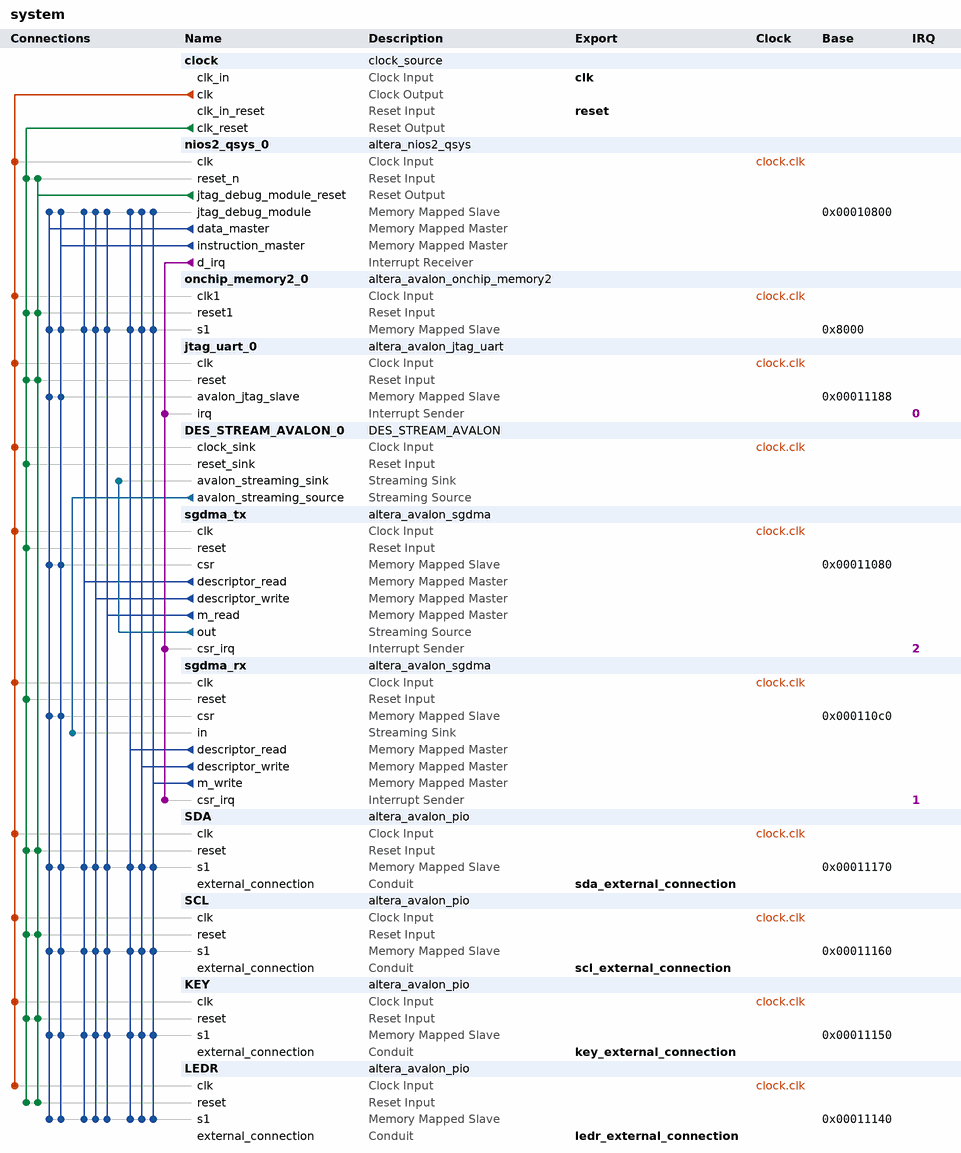
[diagram p0: system contents]
# Platform Designer (Qsys) system system, Cyclone II EP2C35F672C6
# Parameters at their usual value, and those the tool derives, are not listed.
package require -exact qsys 13.0.1.99.2
create_system system
set_project_property DEVICE_FAMILY {Cyclone II}
set_project_property DEVICE EP2C35F672C6

add_instance clock clock_source 13.0
set_instance_parameter_value clock clockFrequency 50000000

add_instance nios2_qsys_0 altera_nios2_qsys 13.0
set_instance_parameter_value nios2_qsys_0 resetSlave onchip_memory2_0.s1
set_instance_parameter_value nios2_qsys_0 mmu_TLBMissExcSlave None
set_instance_parameter_value nios2_qsys_0 exceptionSlave onchip_memory2_0.s1
set_instance_parameter_value nios2_qsys_0 breakSlave nios2_qsys_0.jtag_debug_module
set_instance_parameter_value nios2_qsys_0 impl Tiny
set_instance_parameter_value nios2_qsys_0 icache_size 4096

add_instance onchip_memory2_0 altera_avalon_onchip_memory2 13.0.1.99.2
set_instance_parameter_value onchip_memory2_0 dataWidth 32
set_instance_parameter_value onchip_memory2_0 dualPort false
set_instance_parameter_value onchip_memory2_0 initMemContent true
set_instance_parameter_value onchip_memory2_0 initializationFileName onchip_mem.hex
set_instance_parameter_value onchip_memory2_0 memorySize 32768

add_instance jtag_uart_0 altera_avalon_jtag_uart 13.0.1.99.2
set_instance_parameter_value jtag_uart_0 simInteractiveOptions NO_INTERACTIVE_WINDOWS

add_instance DES_STREAM_AVALON_0 DES_STREAM_AVALON 1.0

add_instance sgdma_tx altera_avalon_sgdma 13.0.1.99.2
set_instance_parameter_value sgdma_tx enableBurstTransfers false
set_instance_parameter_value sgdma_tx enableUnalignedTransfers false
set_instance_parameter_value sgdma_tx readBlockDataWidth 32
set_instance_parameter_value sgdma_tx sinkErrorWidth 0
set_instance_parameter_value sgdma_tx sourceErrorWidth 0
set_instance_parameter_value sgdma_tx transferMode MEMORY_TO_STREAM
set_instance_parameter_value sgdma_tx writeBurstcountWidth 4

add_instance sgdma_rx altera_avalon_sgdma 13.0.1.99.2
set_instance_parameter_value sgdma_rx enableBurstTransfers false
set_instance_parameter_value sgdma_rx enableUnalignedTransfers false
set_instance_parameter_value sgdma_rx readBlockDataWidth 32
set_instance_parameter_value sgdma_rx sinkErrorWidth 0
set_instance_parameter_value sgdma_rx sourceErrorWidth 0
set_instance_parameter_value sgdma_rx transferMode STREAM_TO_MEMORY
set_instance_parameter_value sgdma_rx writeBurstcountWidth 4

add_instance SDA altera_avalon_pio 13.0.1.99.2
set_instance_parameter_value SDA direction Bidir
set_instance_parameter_value SDA width 1

add_instance SCL altera_avalon_pio 13.0.1.99.2
set_instance_parameter_value SCL direction Output
set_instance_parameter_value SCL width 1

add_instance KEY altera_avalon_pio 13.0.1.99.2
set_instance_parameter_value KEY direction Input
set_instance_parameter_value KEY width 4

add_instance LEDR altera_avalon_pio 13.0.1.99.2
set_instance_parameter_value LEDR direction Output
set_instance_parameter_value LEDR width 18

# connections
add_connection clock.clk DES_STREAM_AVALON_0.clock_sink clock
add_connection clock.clk jtag_uart_0.clk clock
add_connection clock.clk KEY.clk clock
add_connection clock.clk LEDR.clk clock
add_connection clock.clk nios2_qsys_0.clk clock
add_connection clock.clk onchip_memory2_0.clk1 clock
add_connection clock.clk SCL.clk clock
add_connection clock.clk SDA.clk clock
add_connection clock.clk sgdma_rx.clk clock
add_connection clock.clk sgdma_tx.clk clock
add_connection clock.clk_reset DES_STREAM_AVALON_0.reset_sink reset
add_connection clock.clk_reset jtag_uart_0.reset reset
add_connection clock.clk_reset KEY.reset reset
add_connection clock.clk_reset LEDR.reset reset
add_connection clock.clk_reset nios2_qsys_0.reset_n reset
add_connection clock.clk_reset onchip_memory2_0.reset1 reset
add_connection clock.clk_reset SCL.reset reset
add_connection clock.clk_reset SDA.reset reset
add_connection clock.clk_reset sgdma_rx.reset reset
add_connection clock.clk_reset sgdma_tx.reset reset
add_connection nios2_qsys_0.jtag_debug_module_reset jtag_uart_0.reset reset
add_connection nios2_qsys_0.jtag_debug_module_reset KEY.reset reset
add_connection nios2_qsys_0.jtag_debug_module_reset LEDR.reset reset
add_connection nios2_qsys_0.jtag_debug_module_reset nios2_qsys_0.reset_n reset
add_connection nios2_qsys_0.jtag_debug_module_reset onchip_memory2_0.reset1 reset
add_connection nios2_qsys_0.jtag_debug_module_reset SCL.reset reset
add_connection nios2_qsys_0.jtag_debug_module_reset SDA.reset reset
add_connection nios2_qsys_0.data_master jtag_uart_0.avalon_jtag_slave avalon
set_connection_parameter_value nios2_qsys_0.data_master/jtag_uart_0.avalon_jtag_slave baseAddress 0x00011188
add_connection nios2_qsys_0.data_master KEY.s1 avalon
set_connection_parameter_value nios2_qsys_0.data_master/KEY.s1 baseAddress 0x00011150
add_connection nios2_qsys_0.data_master LEDR.s1 avalon
set_connection_parameter_value nios2_qsys_0.data_master/LEDR.s1 baseAddress 0x00011140
add_connection nios2_qsys_0.data_master nios2_qsys_0.jtag_debug_module avalon
set_connection_parameter_value nios2_qsys_0.data_master/nios2_qsys_0.jtag_debug_module baseAddress 0x00010800
add_connection nios2_qsys_0.data_master onchip_memory2_0.s1 avalon
set_connection_parameter_value nios2_qsys_0.data_master/onchip_memory2_0.s1 baseAddress 0x8000
add_connection nios2_qsys_0.data_master SCL.s1 avalon
set_connection_parameter_value nios2_qsys_0.data_master/SCL.s1 baseAddress 0x00011160
add_connection nios2_qsys_0.data_master SDA.s1 avalon
set_connection_parameter_value nios2_qsys_0.data_master/SDA.s1 baseAddress 0x00011170
add_connection nios2_qsys_0.data_master sgdma_rx.csr avalon
set_connection_parameter_value nios2_qsys_0.data_master/sgdma_rx.csr baseAddress 0x000110c0
add_connection nios2_qsys_0.data_master sgdma_tx.csr avalon
set_connection_parameter_value nios2_qsys_0.data_master/sgdma_tx.csr baseAddress 0x00011080
add_connection nios2_qsys_0.instruction_master jtag_uart_0.avalon_jtag_slave avalon
set_connection_parameter_value nios2_qsys_0.instruction_master/jtag_uart_0.avalon_jtag_slave baseAddress 0x00011188
add_connection nios2_qsys_0.instruction_master KEY.s1 avalon
set_connection_parameter_value nios2_qsys_0.instruction_master/KEY.s1 baseAddress 0x00011150
add_connection nios2_qsys_0.instruction_master LEDR.s1 avalon
set_connection_parameter_value nios2_qsys_0.instruction_master/LEDR.s1 baseAddress 0x00011140
add_connection nios2_qsys_0.instruction_master nios2_qsys_0.jtag_debug_module avalon
set_connection_parameter_value nios2_qsys_0.instruction_master/nios2_qsys_0.jtag_debug_module baseAddress 0x00010800
add_connection nios2_qsys_0.instruction_master onchip_memory2_0.s1 avalon
set_connection_parameter_value nios2_qsys_0.instruction_master/onchip_memory2_0.s1 baseAddress 0x8000
add_connection nios2_qsys_0.instruction_master SCL.s1 avalon
set_connection_parameter_value nios2_qsys_0.instruction_master/SCL.s1 baseAddress 0x00011160
add_connection nios2_qsys_0.instruction_master SDA.s1 avalon
set_connection_parameter_value nios2_qsys_0.instruction_master/SDA.s1 baseAddress 0x00011170
add_connection nios2_qsys_0.instruction_master sgdma_rx.csr avalon
set_connection_parameter_value nios2_qsys_0.instruction_master/sgdma_rx.csr baseAddress 0x000110c0
add_connection nios2_qsys_0.instruction_master sgdma_tx.csr avalon
set_connection_parameter_value nios2_qsys_0.instruction_master/sgdma_tx.csr baseAddress 0x00011080
add_connection sgdma_rx.descriptor_read KEY.s1 avalon
set_connection_parameter_value sgdma_rx.descriptor_read/KEY.s1 baseAddress 0x00011150
add_connection sgdma_rx.descriptor_read LEDR.s1 avalon
set_connection_parameter_value sgdma_rx.descriptor_read/LEDR.s1 baseAddress 0x00011140
add_connection sgdma_rx.descriptor_read nios2_qsys_0.jtag_debug_module avalon
set_connection_parameter_value sgdma_rx.descriptor_read/nios2_qsys_0.jtag_debug_module baseAddress 0x00010800
add_connection sgdma_rx.descriptor_read onchip_memory2_0.s1 avalon
set_connection_parameter_value sgdma_rx.descriptor_read/onchip_memory2_0.s1 baseAddress 0x8000
add_connection sgdma_rx.descriptor_read SCL.s1 avalon
set_connection_parameter_value sgdma_rx.descriptor_read/SCL.s1 baseAddress 0x00011160
add_connection sgdma_rx.descriptor_read SDA.s1 avalon
set_connection_parameter_value sgdma_rx.descriptor_read/SDA.s1 baseAddress 0x00011170
add_connection sgdma_rx.descriptor_write KEY.s1 avalon
set_connection_parameter_value sgdma_rx.descriptor_write/KEY.s1 baseAddress 0x00011150
add_connection sgdma_rx.descriptor_write LEDR.s1 avalon
set_connection_parameter_value sgdma_rx.descriptor_write/LEDR.s1 baseAddress 0x00011140
add_connection sgdma_rx.descriptor_write nios2_qsys_0.jtag_debug_module avalon
set_connection_parameter_value sgdma_rx.descriptor_write/nios2_qsys_0.jtag_debug_module baseAddress 0x00010800
add_connection sgdma_rx.descriptor_write onchip_memory2_0.s1 avalon
set_connection_parameter_value sgdma_rx.descriptor_write/onchip_memory2_0.s1 baseAddress 0x8000
add_connection sgdma_rx.descriptor_write SCL.s1 avalon
set_connection_parameter_value sgdma_rx.descriptor_write/SCL.s1 baseAddress 0x00011160
add_connection sgdma_rx.descriptor_write SDA.s1 avalon
set_connection_parameter_value sgdma_rx.descriptor_write/SDA.s1 baseAddress 0x00011170
add_connection sgdma_rx.m_write KEY.s1 avalon
set_connection_parameter_value sgdma_rx.m_write/KEY.s1 baseAddress 0x00011150
add_connection sgdma_rx.m_write LEDR.s1 avalon
set_connection_parameter_value sgdma_rx.m_write/LEDR.s1 baseAddress 0x00011140
add_connection sgdma_rx.m_write nios2_qsys_0.jtag_debug_module avalon
set_connection_parameter_value sgdma_rx.m_write/nios2_qsys_0.jtag_debug_module baseAddress 0x00010800
add_connection sgdma_rx.m_write onchip_memory2_0.s1 avalon
set_connection_parameter_value sgdma_rx.m_write/onchip_memory2_0.s1 baseAddress 0x8000
add_connection sgdma_rx.m_write SCL.s1 avalon
set_connection_parameter_value sgdma_rx.m_write/SCL.s1 baseAddress 0x00011160
add_connection sgdma_rx.m_write SDA.s1 avalon
set_connection_parameter_value sgdma_rx.m_write/SDA.s1 baseAddress 0x00011170
add_connection sgdma_tx.descriptor_read KEY.s1 avalon
set_connection_parameter_value sgdma_tx.descriptor_read/KEY.s1 baseAddress 0x00011150
add_connection sgdma_tx.descriptor_read LEDR.s1 avalon
set_connection_parameter_value sgdma_tx.descriptor_read/LEDR.s1 baseAddress 0x00011140
add_connection sgdma_tx.descriptor_read nios2_qsys_0.jtag_debug_module avalon
set_connection_parameter_value sgdma_tx.descriptor_read/nios2_qsys_0.jtag_debug_module baseAddress 0x00010800
add_connection sgdma_tx.descriptor_read onchip_memory2_0.s1 avalon
set_connection_parameter_value sgdma_tx.descriptor_read/onchip_memory2_0.s1 baseAddress 0x8000
add_connection sgdma_tx.descriptor_read SCL.s1 avalon
set_connection_parameter_value sgdma_tx.descriptor_read/SCL.s1 baseAddress 0x00011160
add_connection sgdma_tx.descriptor_read SDA.s1 avalon
set_connection_parameter_value sgdma_tx.descriptor_read/SDA.s1 baseAddress 0x00011170
add_connection sgdma_tx.descriptor_write KEY.s1 avalon
set_connection_parameter_value sgdma_tx.descriptor_write/KEY.s1 baseAddress 0x00011150
add_connection sgdma_tx.descriptor_write LEDR.s1 avalon
set_connection_parameter_value sgdma_tx.descriptor_write/LEDR.s1 baseAddress 0x00011140
add_connection sgdma_tx.descriptor_write nios2_qsys_0.jtag_debug_module avalon
set_connection_parameter_value sgdma_tx.descriptor_write/nios2_qsys_0.jtag_debug_module baseAddress 0x00010800
add_connection sgdma_tx.descriptor_write onchip_memory2_0.s1 avalon
set_connection_parameter_value sgdma_tx.descriptor_write/onchip_memory2_0.s1 baseAddress 0x8000
add_connection sgdma_tx.descriptor_write SCL.s1 avalon
set_connection_parameter_value sgdma_tx.descriptor_write/SCL.s1 baseAddress 0x00011160
add_connection sgdma_tx.descriptor_write SDA.s1 avalon
set_connection_parameter_value sgdma_tx.descriptor_write/SDA.s1 baseAddress 0x00011170
add_connection sgdma_tx.m_read KEY.s1 avalon
set_connection_parameter_value sgdma_tx.m_read/KEY.s1 baseAddress 0x00011150
add_connection sgdma_tx.m_read LEDR.s1 avalon
set_connection_parameter_value sgdma_tx.m_read/LEDR.s1 baseAddress 0x00011140
add_connection sgdma_tx.m_read nios2_qsys_0.jtag_debug_module avalon
set_connection_parameter_value sgdma_tx.m_read/nios2_qsys_0.jtag_debug_module baseAddress 0x00010800
add_connection sgdma_tx.m_read onchip_memory2_0.s1 avalon
set_connection_parameter_value sgdma_tx.m_read/onchip_memory2_0.s1 baseAddress 0x8000
add_connection sgdma_tx.m_read SCL.s1 avalon
set_connection_parameter_value sgdma_tx.m_read/SCL.s1 baseAddress 0x00011160
add_connection sgdma_tx.m_read SDA.s1 avalon
set_connection_parameter_value sgdma_tx.m_read/SDA.s1 baseAddress 0x00011170
add_connection DES_STREAM_AVALON_0.avalon_streaming_source sgdma_rx.in avalon_streaming
add_connection sgdma_tx.out DES_STREAM_AVALON_0.avalon_streaming_sink avalon_streaming
add_connection nios2_qsys_0.d_irq jtag_uart_0.irq interrupt
set_connection_parameter_value nios2_qsys_0.d_irq/jtag_uart_0.irq irqNumber 0
add_connection nios2_qsys_0.d_irq sgdma_rx.csr_irq interrupt
set_connection_parameter_value nios2_qsys_0.d_irq/sgdma_rx.csr_irq irqNumber 1
add_connection nios2_qsys_0.d_irq sgdma_tx.csr_irq interrupt
set_connection_parameter_value nios2_qsys_0.d_irq/sgdma_tx.csr_irq irqNumber 2

# exported interfaces
add_interface clk clock sink
set_interface_property clk EXPORT_OF clock.clk_in
add_interface reset reset sink
set_interface_property reset EXPORT_OF clock.clk_in_reset
add_interface sda_external_connection conduit end
set_interface_property sda_external_connection EXPORT_OF SDA.external_connection
add_interface key_external_connection conduit end
set_interface_property key_external_connection EXPORT_OF KEY.external_connection
add_interface scl_external_connection conduit end
set_interface_property scl_external_connection EXPORT_OF SCL.external_connection
add_interface ledr_external_connection conduit end
set_interface_property ledr_external_connection EXPORT_OF LEDR.external_connection

set_interconnect_requirement {$system} qsys_mm.clockCrossingAdapter HANDSHAKE
set_interconnect_requirement {$system} qsys_mm.maxAdditionalLatency 1

save_system system.qsys
